# Altium schematic sheet Sheet1.SchDoc
size 279 x 215 mm
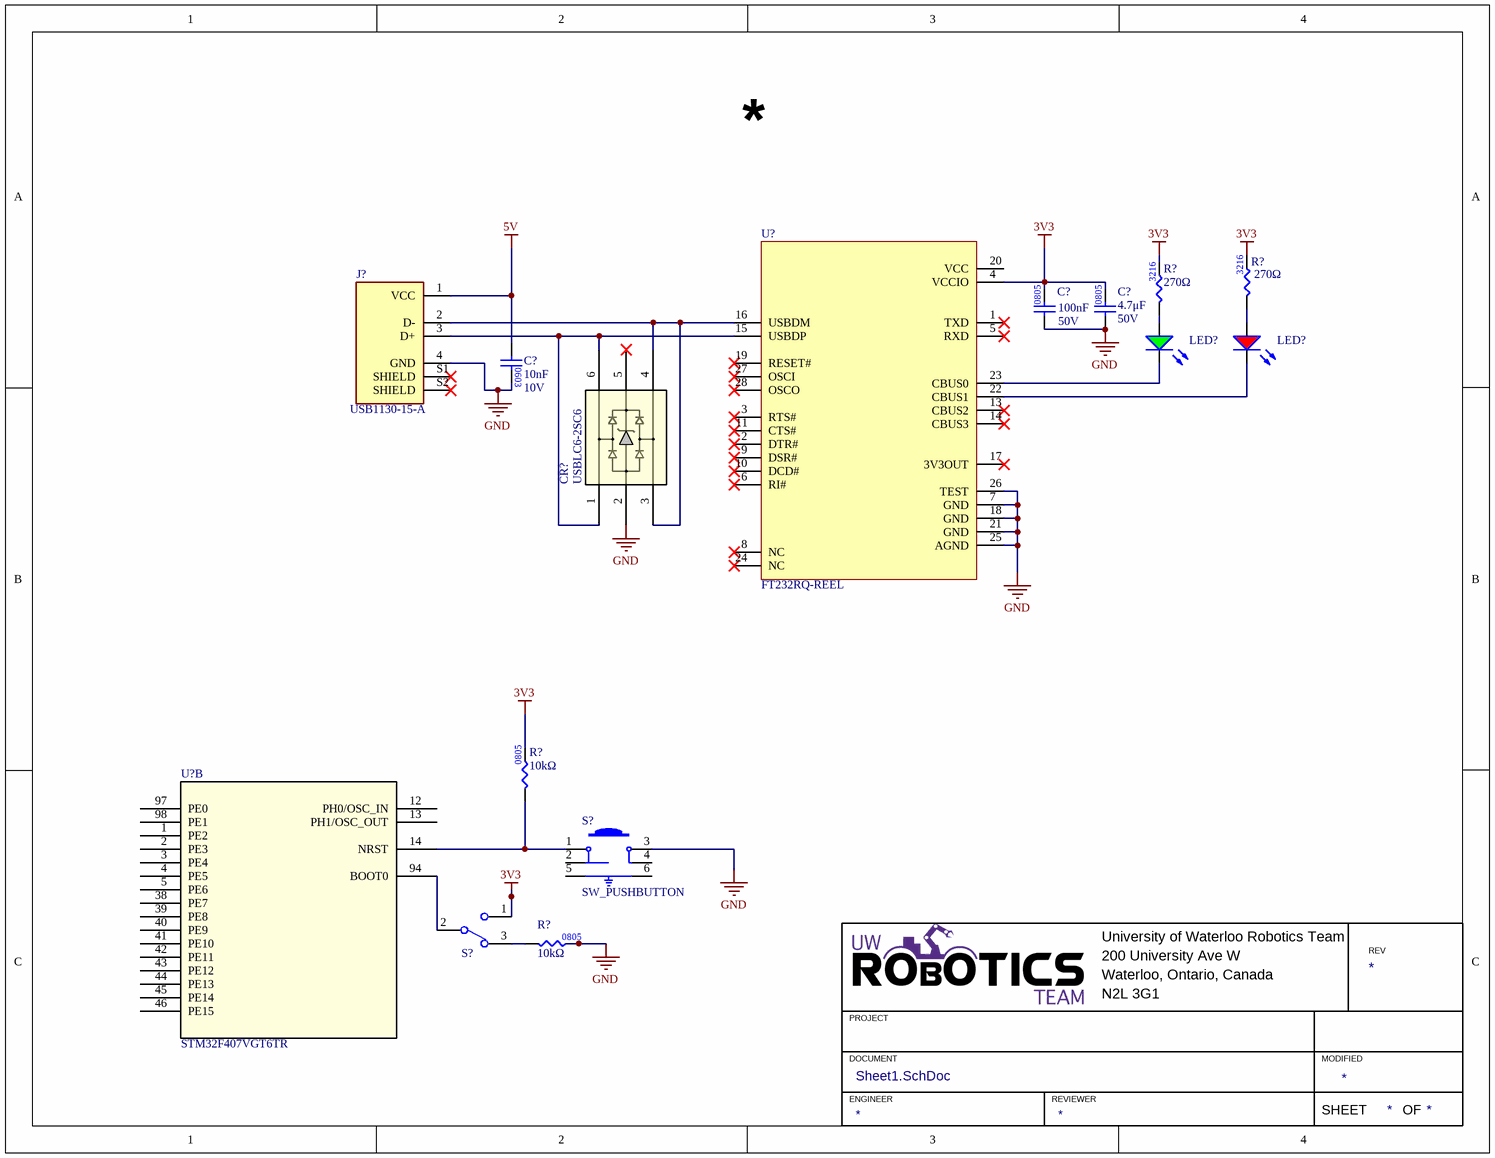
[diagram p0: Sheet1.SchDoc]

## Parts
(Parts that share a designator on the sheet are numbered #1, #2 ... from top to bottom, then left to right.)
C?#1  value 100nF  Voltage Rating: 50V  [CAP0805]  (hidden comment: CAP_100nF_50V_0805)
C?#2  value 4.7μF  Voltage Rating: 50V  [CAP0805]  (hidden comment: CAP_4.7uF_50V_0805)
C?#3  value 10nF  Voltage Rating: 10V  [CAP0603]  (hidden comment: CAP_10nF_25V_0603)
CR?  USBLC6-2SC6  [SOT23-6L_STM]
J?  Manufacturer Part Number 1: USB1130-15-A  [USB-A 2.0 Connector - 3d ver]  (hidden comment: USB-A 2.0 Connector)
LED?#1  LED_RED  [LED_0805_RED]  (value not drawn)
LED?#2  LED_GREEN  [LED_0805_GREEN]  (value not drawn)
R?#1  value 270Ω  [RES1206]  (hidden comment: Res_270_Ohms)
R?#2  value 270Ω  [RES1206]  (hidden comment: Res_270_Ohms)
R?#3  value 10kΩ  [RES0805]  (hidden comment: RES_10kΩ_0805_5%)
R?#4  value 10kΩ  [RES0805]  (hidden comment: RES_10kΩ_0805_5%)
S?#1  SW_PUSHBUTTON  [TACTILE_SWITCH_SMD]
S?#2  SW_TOGGLE_SPDT  [100SP1T1B4M2QE]  (value not drawn)
U?#1  FT232RQ-REEL  [FT232RQ-REEL_FTD]
U?#2  STM32F407VGT6TR  [LQFP100-14x14mm]  (part B of 3)

## Nets
3V3: C?#1.2 C?#2.2 R?#1.2 R?#2.2 R?#3.2 S?#2.1 U?#1.4(VCCIO)
5V: C?#3.1 J?.1(VCC)
GND: C?#1.1 C?#2.1 C?#3.2 CR?.2 J?.4(GND) R?#4.2 S?#1.3 U?#1.7(GND) U?#1.18(GND) U?#1.21(GND) U?#1.25(AGND) U?#1.26(TEST)
NetCR?_1: CR?.1 CR?.6 J?.3(D+) U?#1.15(USBDP)
NetCR?_3: CR?.3 CR?.4 J?.2(D-) U?#1.16(USBDM)
NetLED?#1_1: LED?#1.1(A) R?#1.1
NetLED?#1_2: LED?#1.2(K) U?#1.22(CBUS1)
NetLED?#2_1: LED?#2.1(A) R?#2.1
NetLED?#2_2: LED?#2.2(K) U?#1.23(CBUS0)
NetR?#3_1: R?#3.1 S?#1.1 U?#2.14(NRST)
NetR?#4_1: R?#4.1 S?#2.3
NetS?#2_2: S?#2.2 U?#2.94(BOOT0)

Not connected (* = marked no-connect by the designer): CR? 5*; J? S1(SHIELD)* S2(SHIELD)*; S?#1 2 4 5 6; U?#1 1(TXD)* 2(DTR#)* 3(RTS#)* 5(RXD)* 6(RI#)* 8(NC)* 9(DSR#)* 10(DCD#)* 11(CTS#)* 13(CBUS2)* 14(CBUS3)* 17(3V3OUT)* 19(RESET#)* 20(VCC) 24(NC)* 27(OSCI)* 28(OSCO)*; U?#2 1(PE2) 2(PE3) 3(PE4) 4(PE5) 5(PE6) 12(PH0/OSC_IN) 13(PH1/OSC_OUT) 38(PE7) 39(PE8) 40(PE9) 41(PE10) 42(PE11) 43(PE12) 44(PE13) 45(PE14) 46(PE15) 97(PE0) 98(PE1)

## Notes on the sheet
- University of Waterloo Robotics Team
- 200 University Ave W
- REV
- PROJECT
- Waterloo, Ontario, Canada
- N2L 3G1
- DOCUMENT
- ENGINEER
- REVIEWER
- MODIFIED
- SHEET
- OF
- (in symbol CAP_10nF_25V_0603) 0603
- (in symbol Res_270_Ohms) 3216

## Library data of the parts
C?#1 = CAP_100nF_50V_0805: CAP CER 0.1UF 50V X7R 0805; Manufacturer 1: Samsung Electro-Mechanics; Manufacturer Part Number 1: CL21B104KBCNNNC; Package/Footprint: 0805; Supplier 1: Digi-Key; Supplier Part Number 1: 1276-1003-1-ND
C?#2 = CAP_4.7uF_50V_0805: CAP CER 4.7UF 50V X5R 0805; Manufacturer 1: TDK Corporation; Manufacturer Part Number 1: CGA4J3X5R1H475K125AB; Mounting Type: SMD; Supplier 1: Digi-Key; Supplier Part Number 1: 445-7882-1-ND; Package: 0805; LCSC Part #: C1779; Dielectric: X5R
C?#3 = CAP_10nF_25V_0603: CAP CER 10000PF 25V C0G 0603; Manufacturer Part Number 1: C1608C0G1E103J080AA; Manufacturer 1: Yageo; Supplier Part Number 1: 445-2664-1-ND; Supplier 1: Digi-Key; Dielectric: C0G
CR? = USBLC6-2SC6: 17V Clamp 5A (8/20µs) Ipp Tvs Diode Surface Mount SOT-23-6; Mfr_Name: STMicroelectronics; RefDes: RefDes; Type: Type; Supplier 1: Mouser; Supplier Part Number 1: 511-USBLC6-2SC6
J? = USB-A 2.0 Connector: USB-A (USB TYPE-A) USB 2.0 Receptacle Connector 4 Position Through Hole, Right Angle; Manufacturer 1: GCT; Supplier 1: Digi-Key; Supplier Part Number 1: 2073-USB1130-15-ACT-ND
LED?#1 = LED_RED: LED RED DIFFUSED 0805 SMD; Manufacturer 1: OSRAM; Manufacturer Part Number 1: LS R976-NR-1; Package/Footprint: 0805; Forward Voltage Drop: 2V; Forward Current: 20mA; Supplier Part Number 1: 475-1278-1-ND; Supplier 1: Digi-Key; Mounting Type: SMD
LED?#2 = LED_GREEN: LED GREEN DIFFUSED 0805 SMD; Manufacturer 1: OSRAM; Manufacturer Part Number 1: LG R971-KN-1; Forward Voltage Drop: 2.2V; Package/Footprint: 0805; Supplier Part Number 1: 475-1410-1-ND; Supplier 1: Digi-Key; Mounting Type: SMD
R?#1 R?#2 = Res_270_Ohms: 270 Ohms ±5% 0.25W, 1/4W Chip Resistor 1206 (3216 Metric) Moisture Resistant Thick Film; Manufacturer Part Number 1: RC0402FR-0786K6L; Manufacturer 1: Yageo; Power: 0.063W, 1/16W; Tolerance: 1%; Package/Footprint: 0402; Supplier 1: Digi-Key; Supplier Part Number 1: YAG3249CT-ND; Mounting Type: SMD
R?#3 R?#4 = RES_10kΩ_0805_5%: RES 10K OHM 5% 1/8W 0805; Manufacturer 1: Panasonic Electronic Components; Manufacturer Part Number 1: ERJ-6GEYJ103V; Package/Footprint: 0805; Supplier 1: Digi-Key; Supplier Part Number 1: P10KACT-ND; LCSC Part #: C17414; Mounting Type: SMD
S?#1 = SW_PUSHBUTTON: SMT 3.0 X 2.6 MM TACT SWITCH WIT; Manufacturer 1: Würth Elektronik; Manufacturer Part Number 1: 435151014824; Supplier 1: Digi-Key; Supplier Part Number 1: 732-435151014824CT-ND
S?#2 = SW_TOGGLE_SPDT: SWITCH TOGGLE SPDT 5A 120V; Manufacturer 1: E-Switch; Voltage Rating (DC): 28V; Package/Footprint: TH; Supplier 1: Digi-Key; Mounting Type: TH; Throw Configuration: SPDT; Supplier Part Number 1: EG2355-ND; Manufacturer Part Number 1: 100SP1T1B4M2QE
U?#1 = FT232RQ-REEL: USB Bridge, USB to UART USB 2.0 UART Interface 32-QFN (5x5); Manufacturer: FTDI; Max Frequency: 48MHz; Package Equivalence Code: LCC32,.2SQ,20; Max Supply Voltage: 5.25V; Min Supply Voltage: 3.3V; Max Supply Current: 100uA; Qualification Status: Not Qualified; Supplier 1: Digi-Key; Supplier Part Number 1: 768-1008-1-ND; RoHS: Yes; Category: Interface ICs; Pricing 1: 1=4.70000, 10=4.25000, 50=4.05000, 100=3.85000, 250=3.45000, 500=3.05000, 1000=2.85002, 2500=2.55001 (USD); Package Code: HVQCCN; Number of Pins: 32; Package Shape: Square; Min Operating Temperature: -40°C; Max Operating Temperature: 85°C; JESD-30 Code: S-XQCC-N32; Moisture Sensitivity Level: 3; Package Style: CHIP CARRIER, HEAT SINK/SLUG, VERY THIN PROFILEMeter; Surface Mount: Yes; Technology: CMOS; Terminal Form: No Lead; Terminal Position: QUAD; Length: 5mm; Width: 5mm; Height - Seated (Max): 1mm; Terminal Pitch: 0.5mm; Temperature Grade: INDUSTRIAL; REACH SVHC: Yes; RoHS Compliant: Yes; ComponentLink1URL: https://datasheet.ciiva.com:443/pdfs/VipMasterIC/IC/FTDI/FTDI-S-A0007980421/FTDI-S-A0007980421-1.pdf?src-supplier=IHS+Markit; ComponentLink1Description: https://datasheet.ciiva.com:443/pdfs/VipMasterIC/IC/FTDI/FTDI-S-A0007980421/FTDI-S-A0007980421-1.pdf?src-supplier=IHS+Markit; ComponentLink2URL: https://datasheet.ciiva.com/1505/1647396-1505445.pdf?src-supplier=Digi-Key; ComponentLink2Description: https://datasheet.ciiva.com/1505/1647396-1505445.pdf?src-supplier=Digi-Key; ComponentLink3URL: https://datasheet.ciiva.com/26841/ft232rq-reel-26841082.pdf?src-supplier=IIIC; ComponentLink3Description: https://datasheet.ciiva.com/26841/ft232rq-reel-26841082.pdf?src-supplier=IIIC; ComponentLink4URL: https://datasheet.ciiva.com/16438/ds-ft232r-16438555.pdf?src-supplier=Future+Electronics; ComponentLink4Description: https://datasheet.ciiva.com/16438/ds-ft232r-16438555.pdf?src-supplier=Future+Electronics; ComponentLink5URL: https://datasheet.ciiva.com/15150/getdatasheetpartid-644721-15150509.pdf?src-supplier=Verical; ComponentLink5Description: https://datasheet.ciiva.com/15150/getdatasheetpartid-644721-15150509.pdf?src-supplier=Verical; ComponentLink6URL: https://datasheet.ciiva.com/4787/ds-ft232r-4787663.pdf?src-supplier=Mouser; ComponentLink6Description: https://datasheet.ciiva.com/4787/ds-ft232r-4787663.pdf?src-supplier=Mouser; ComponentLink7URL: https://datasheet.ciiva.com/1787/ds-ft232r-1787041.pdf?src-supplier=Digi-Key; ComponentLink7Description: https://datasheet.ciiva.com/1787/ds-ft232r-1787041.pdf?src-supplier=Digi-Key; ComponentLink8URL: https://datasheet.ciiva.com/1787/ds-ft232r-1787042.pdf?src-supplier=Digi-Key; ComponentLink8Description: https://datasheet.ciiva.com/1787/ds-ft232r-1787042.pdf?src-supplier=Digi-Key; Manufacturer Part Number: FT232RQ-REEL
U?#2 = STM32F407VGT6TR: ARM® Cortex®-M4 STM32F4 Microcontroller IC 32-Bit Single-Core 168MHz 1MB (1M x 8) FLASH 100-LQFP (14x14); Mfr_Name: STMicroelectronics; Connectivity: CANbus, DCMI, EBI/EMI, Ethernet, I2C, IrDA, LINbus, SPI, UART/USART, USB OTG; Peripherals: Brown-out Detect/Reset, DMA, I2S, LCD, POR, PWM, WDT; Core Processor: ARM® Cortex®-M4; Core Size: 32-Bit Single-Core; Supplier Device Package: 100-LQFP (14x14)